# Altium schematic sheet 10 usb host port.SchDoc
size A3; SheetNumber: 14; SheetTotal: 16
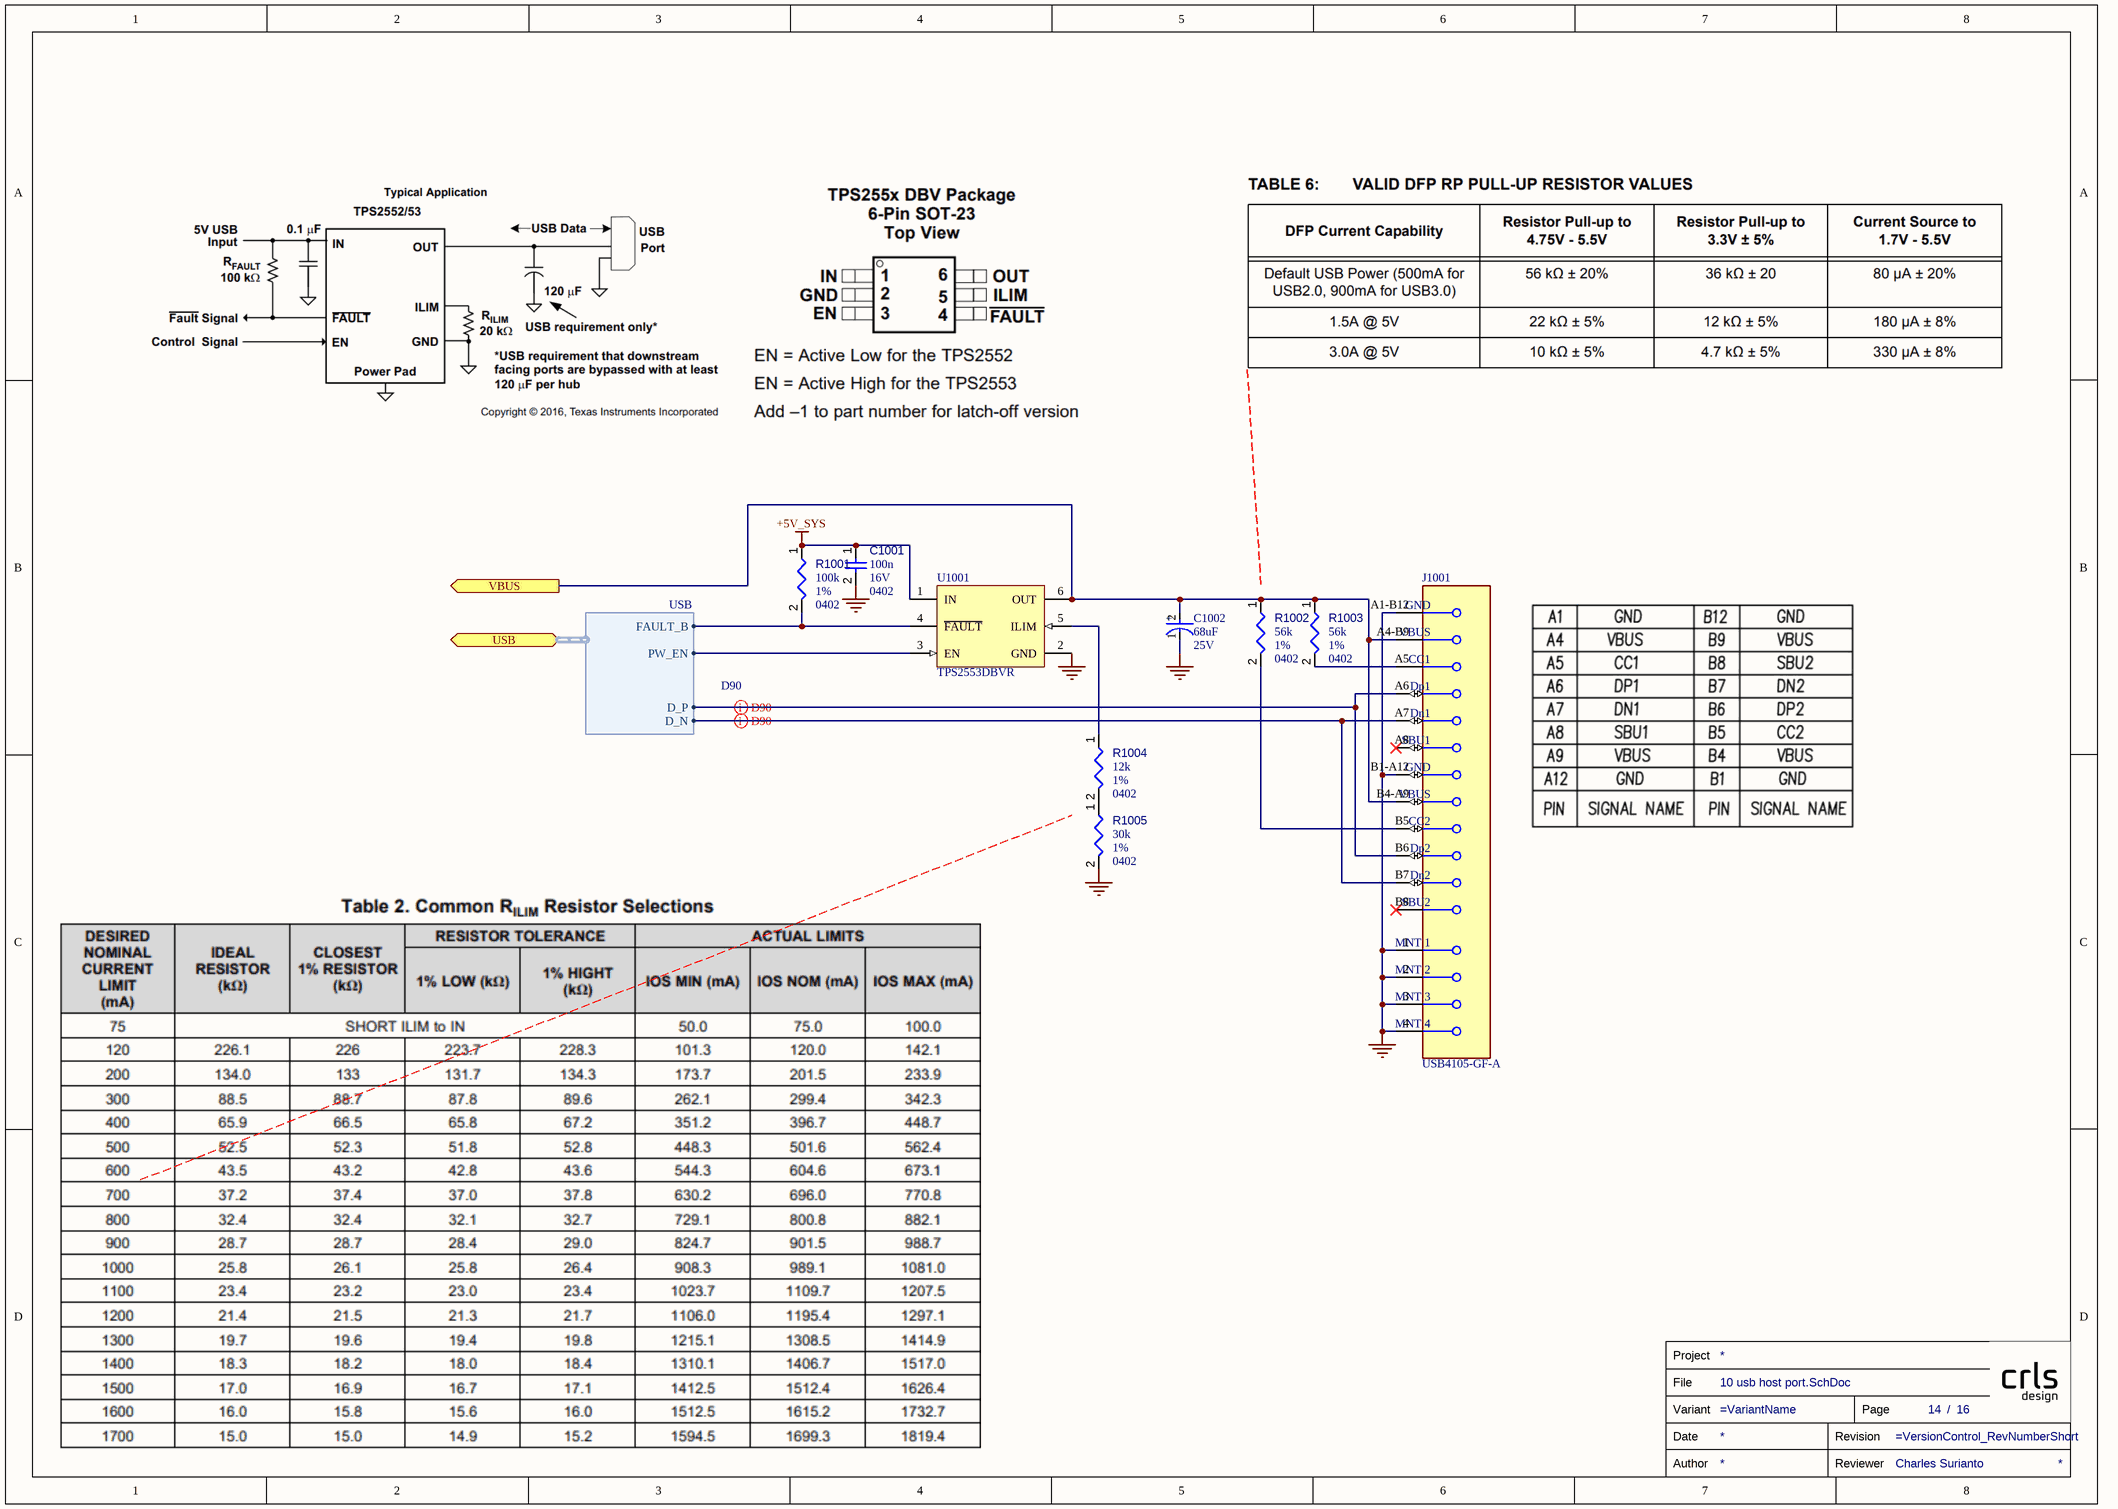
[diagram p0: 10 usb host port.SchDoc]

## Parts
C1001  value 100n  Case/Package: 0402  Voltage Rating: 16V  [CAPC0402(1005)60_L]  (hidden comment: Capacitors,0402,100n,16V)
C1002  Voltage Rating: 25V  Capacitance: 68uF  [FP-POSCAP-D3L-MFG]  (hidden comment: 25TQC68MYF)
J1001  USB4105-GF-A  [FP-USB4105-GF-A-MFG]
R1001  value 100k  Case/Package: 0402  Tolerance: 1%  [RESC0402(1005)_L]  (hidden comment: Resistors,0402,1%,100k)
R1002  value 56k  Case/Package: 0402  Tolerance: 1%  [RESC0402(1005)_L]  (hidden comment: Resistors,0402,1%,56k)
R1003  value 56k  Case/Package: 0402  Tolerance: 1%  [RESC0402(1005)_L]  (hidden comment: Resistors,0402,1%,56k)
R1004  value 12k  Case/Package: 0402  Tolerance: 1%  [RESC0402(1005)_L]  (hidden comment: Resistors,0402,1%,12k)
R1005  value 30k  Case/Package: 0402  Tolerance: 1%  [RESC0402(1005)_L]  (hidden comment: Resistors,0402,1%,30k)
TB?  Reviewer: Charles Surianto  (hidden comment: TITLE_BLOCK)  (graphical)
U1001  TPS2553DBVR  [DBV0006A_M]

## Ports
USB (bidir, harness USB), VBUS (out)

## Harnesses
USB: FAULT_B, PW_EN, D_P, D_N

## Nets
+5V_SYS: C1001.1 R1001.1 U1001.1(IN)
GND: C1001.2 C1002.1(C) J1001.1(MNT_1) J1001.2(MNT_2) J1001.3(MNT_3) J1001.4(MNT_4) J1001.A1-B12(GND) J1001.B1-A12(GND) R1005.2 U1001.2(GND)
VBUS: C1002.2(A) J1001.A4-B9(VBUS) J1001.B4-A9(VBUS) R1002.1 R1003.1 U1001.6(OUT) ; port VBUS
NetJ1001_A5: J1001.A5(CC1) R1003.2
NetJ1001_A6: J1001.A6(Dp1) J1001.B6(Dp2) ; port USB.D_P
NetJ1001_A7: J1001.A7(Dn1) J1001.B7(Dn2) ; port USB.D_N
NetJ1001_B5: J1001.B5(CC2) R1002.2
NetR1001_2: R1001.2 U1001.4(~{FAULT}) ; port USB.FAULT_B
NetR1004_1: R1004.1 U1001.5(ILIM)
NetR1004_2: R1004.2 R1005.1
NetU1001_3: U1001.3(EN) ; port USB.PW_EN

Not connected (* = marked no-connect by the designer): J1001 A8(SBU1)* B8(SBU2)*

## Layout directives
differential pair; differential pair class D90: NetJ1001_A6, NetJ1001_A7

## Notes on the sheet
- (in symbol CMP-05428-000983-1) +
- (in symbol TITLE_BLOCK) Project; File; Variant; Page; /; Date; Revision; Author; Reviewer

## Library data of the parts
C1001 = Capacitors: Capacitor; Component Type: Capacitors
C1002 = CMP-05428-000983-1: Molded Tantalum Polymer Capacitor 68uF 20% 25V life 2000Hours SMD 2917; ESR (Equivalent Series Resistance): 70mR; Lead Free: Lead Free; Packaging: Tape and Reel; Max Operating Temperature: 105°C; Features: General Purpose; REACH SVHC: No SVHC; RoHS Compliant: Yes; Voltage Rating (DC): 25V; Mount: Surface Mount; Min Operating Temperature: -55°C; Case Code (Imperial): 2917; Case Code (Metric): 7343; Tolerance: 20%; Series: POSCAP™ TQC; Case/Package: 2917; Package Quantity: 2500
J1001 = CMP-245163-000001-1: CONN RCPT USB2.0 TYPEC 5A; Manufacturer: GCT; Voltage Rating: 20V; Is Female: yes; Current Rating: 5/6.25/1.25/0.25A; Number Of Contacts: 16; Conn Orientation: Right Angle; Device Class L1: Connectors; Category: Conn; Lead Free: Yes; RoHS: TRUE; Temperature Range High: +85°C; Digikey Description: CONN RCPT USB2.0 TYPEC 5A; Device Class L3: unset; ComponentLink2Description: Datasheet; Manufacturer Part Number: USB4105-GF-A; Package: 0; Usb Standard: USB 2.0; Device Class L2: USB Connectors; Automotive: No; Temperature Range Low: -40°C; Height: 3.46mm; Temperature: -40°C to +85°C; Contact Material: Gold,Nickel; ComponentLink2URL: https://gct.co/files/drawings/usb4105.pdf; Octopart: https://octopart.com/usb4105-gf-a-gct-106627878
R1001-R1005 = Resistors: Resistor; Component Type: Resistors
U1001 = CMP-0337-00284-2: Adjustable, Active High, Constant-Current, Current-Limited Power-Distribution Switch, 0.075 to 1.7 A Current Limit, -40 to 85 degC, 6-pin SOT-23 (DBV), Green (RoHS & no Sb/Br); Manufacturer: Texas Instruments; Continuous Current(Max)(A): 1.5; Vin(Min)(V): 2.5; Current Limit Accuracy @ 1A: +/-7.5% (925mA min / 1075mA max); Vin(Max)(V): 6.5; Rating: Catalog; rDS(on) per FET(Typ)(mOhms): 100/DRV, 85/DBV; Number of Switches: 1; ComponentLink1Description: Datasheet; PartNumber: TPS2553DBVR; Enable: Active High; PackageDescription: 6-Pin Plastic Small-Outline Package, 2.9 x 1.6 mm Body, 0.95 mm Pitch, 2.8 mm Lead Span; DatasheetVersion: SLVS841E; Code_JEDEC: MO-178-AB*; Current Limit Topology: Constant-Current; Mounting Technology: Surface Mount; Eco-Plan: Green (RoHS & no Sb/Br); PackageVersion: revK, Mar-2006; PackageReference: DBV0006A; ComponentLink1URL: http://www.ti.com/general/docs/lit/getliterature.tsp?genericPartNumber=TPS2553&fileType=pdf; Current Limit(A): 0.075 to 1.7
TB? = TITLE_BLOCK: Review Date: *